# EAGLE schematic CD (EAGLE 7.2.0)

## Sheet 1 of 2
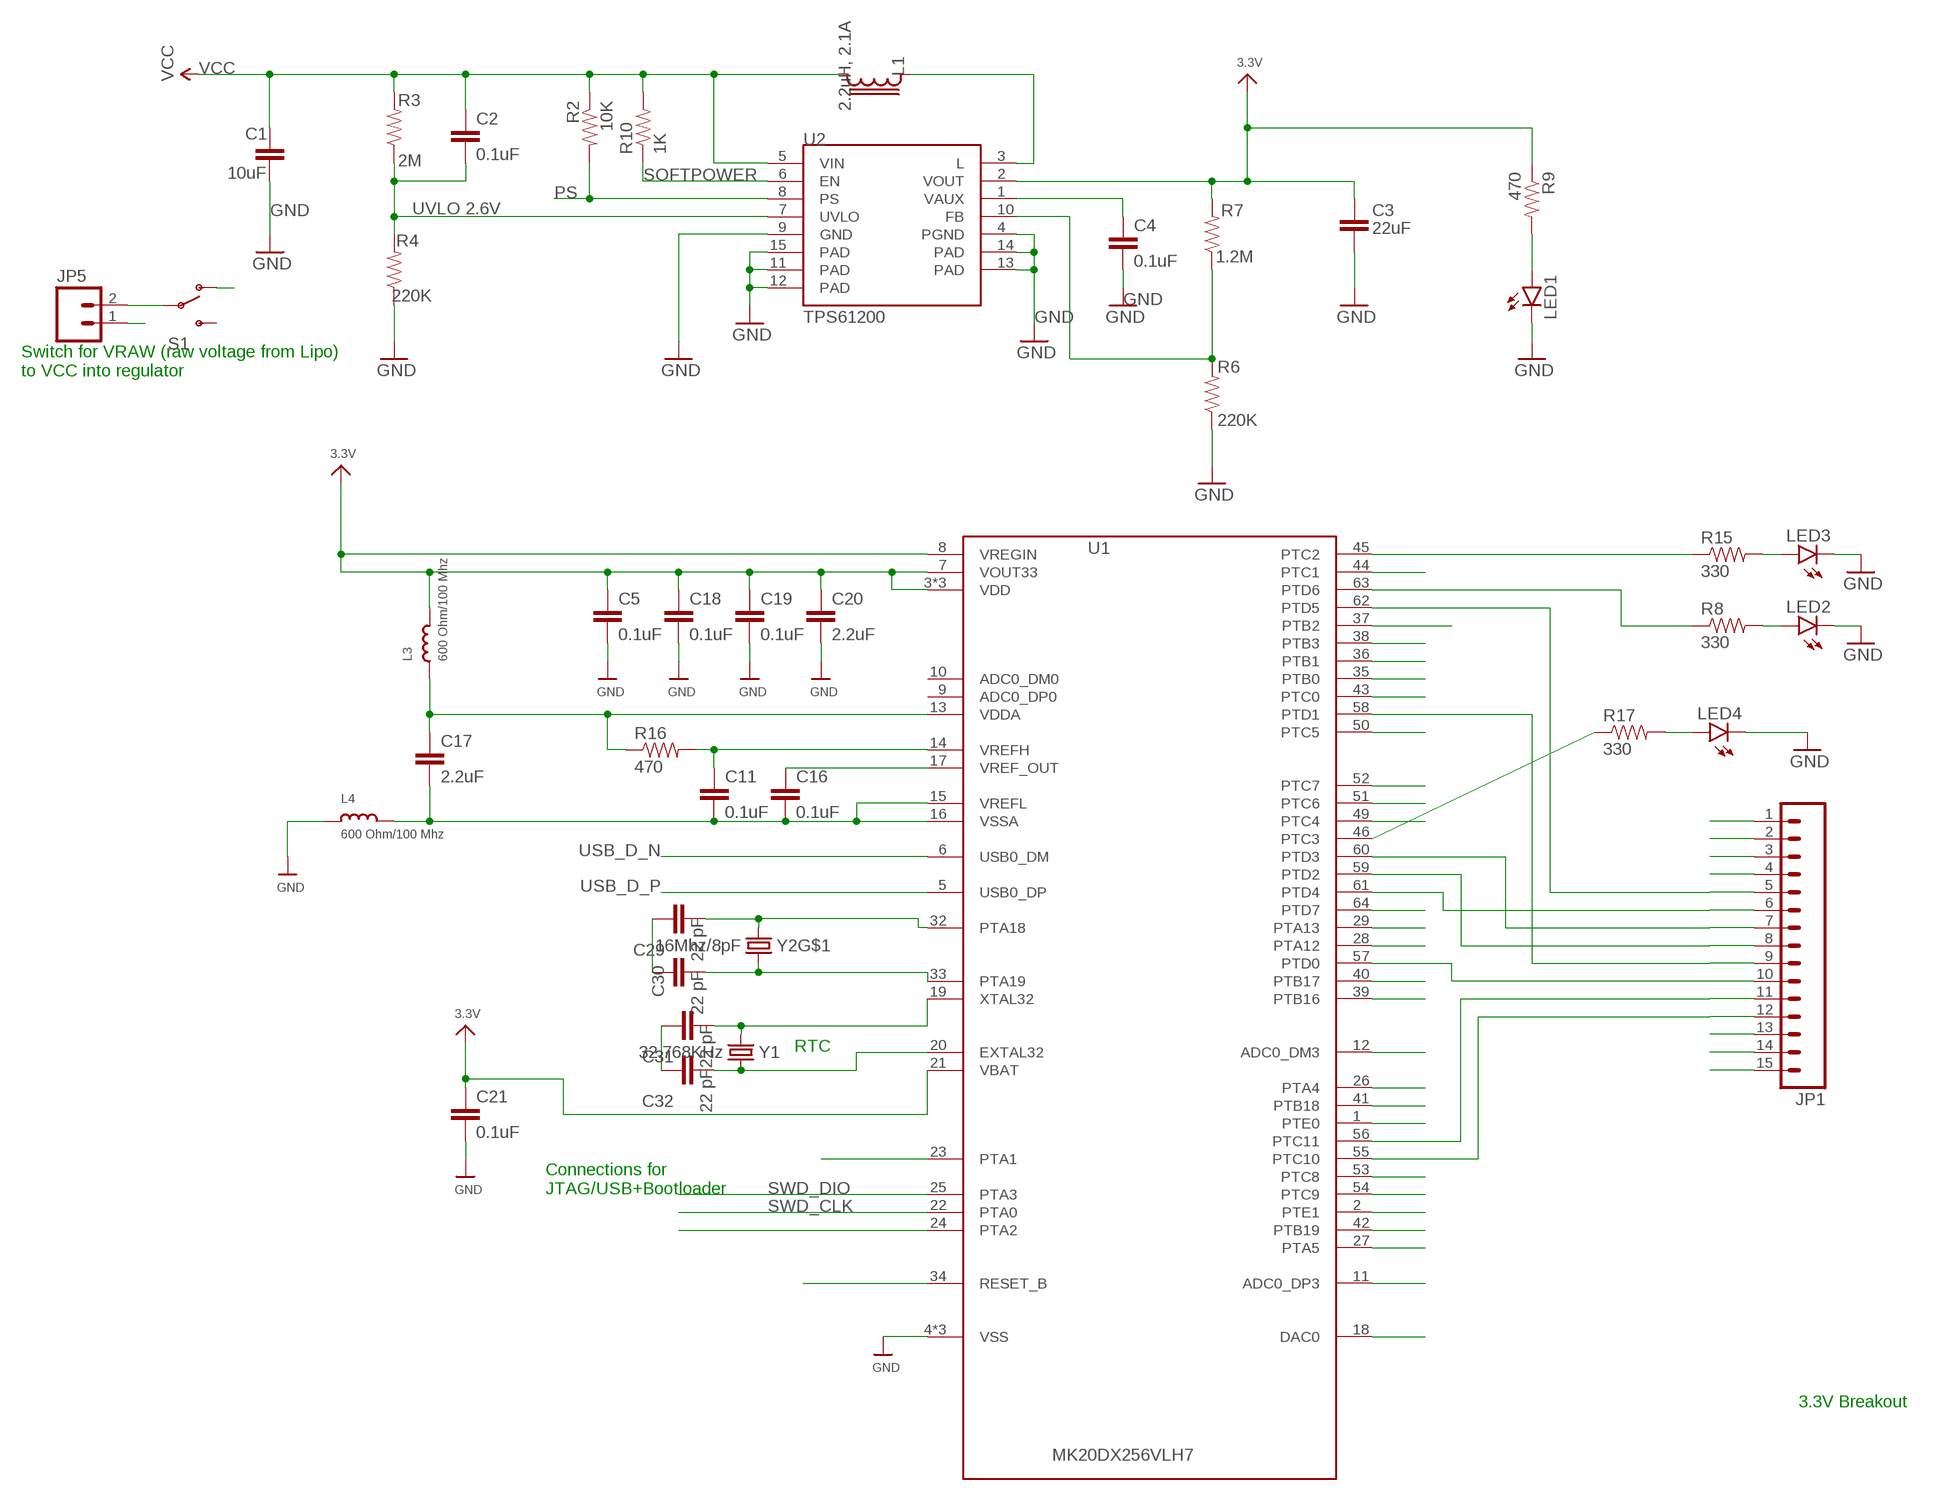
[diagram p0: schematic, sheet 1]

### Parts
C1  10uF  CAPACITOR-10UF  [0603-CAP]
C2  0.1uF  CAPACITOR-0.1UF  [0603-CAP]
C3  22uF  CAPACITOR-22UF  [0603-CAP]
C4  0.1uF  CAPACITOR-0.1UF  [0603-CAP]
C5  0.1uF  CAPACITOR-0.1UF  [0603-CAP]
C11  0.1uF  CAPACITOR-0.1UF  [0603-CAP]
C16  0.1uF  CAPACITOR-0.1UF  [0603-CAP]
C17  2.2uF  CAPACITOR-2.2UF  [0603-CAP]
C18  0.1uF  CAPACITOR-0.1UF  [0603-CAP]
C19  0.1uF  CAPACITOR-0.1UF  [0603-CAP]
C20  2.2uF  CAPACITOR-2.2UF  [0603-CAP]
C21  0.1uF  CAPACITOR-0.1UF  [0603-CAP]
C29  22 pF  CAPACITOR-10UF  [0603-CAP]
C30  22 pF  CAPACITOR-10UF  [0603-CAP]
C31  22 pF  CAPACITOR-10UF  [0603-CAP]
C32  22 pF  CAPACITOR-10UF  [0603-CAP]
JP1  M15  [1X15]
JP5  M02PTH  [1X02]
L1  2.2uH, 2.1A  LPS30152.2UH  [LPS3015]
L3  600 Ohm/100 Mhz  INDUCTOR-BK2125HM601-T  [0805]
L4  600 Ohm/100 Mhz  INDUCTOR-BK2125HM601-T  [0805]
LED1  LED-GREEN  [LED-0603]
LED2  LED-GREEN  [LED-0603]
LED3  LED-GREEN  [LED-0603]
LED4  LED-GREEN  [LED-0603]
R2  10K  RESISTOR-10K  [0603-RES]
R3  2M  RESISTOR-2M  [0603-RES]
R4  220K  RESISTOR-220K  [0603-RES]
R6  220K  RESISTOR-220K  [0603-RES]
R7  1.2M  RESISTOR-1.2M  [0603-RES]
R8  330  RESISTOR-470  [0603-RES]
R9  470  RESISTOR-470  [0603-RES]
R10  1K  RESISTOR-1K  [0603-RES]
R15  330  RESISTOR-470  [0603-RES]
R16  470  RESISTOR-470  [0603-RES]
R17  330  RESISTOR-470  [0603-RES]
S1  SWITCH-SPDT-SMD-A  [SWITCH-SPST-SMD-A]
U1  MK20DX256VLH7  [MK20DX256VLH7]
U2  TPS61200  [QFN-10_PAD]
Y1  32.768KHz  CRYSTAL/32.768KHZ/SMD-TXC_7A  [CRYSTAL-TXC-7A]
Y2  16Mhz/8pF  CRYSTAL/SMD-5X3-GND16MHZ/8PF  [CRYSTAL-SMD-5X3]

### Nets
3.3V: C3.1 C5.1 C18.1 C19.1 C20.1 C21.1 JP1.13 JP1.14 JP1.15 L3.2 R7.2 R9.1 U1.3(VDD) U1.7(VOUT33) U1.8(VREGIN) U1.21(VBAT) U1.30(VDD) U1.48(VDD) U2.2(VOUT) ; also sheet 2
A12: U1.11(ADC0_DP3)
A13: U1.12(ADC0_DM3)
AD0: U1.39(PTB16) ; also sheet 2
DAC/A14: U1.18(DAC0)
FB: R6.2 R7.1 U2.10(FB)
GND [Top GND Pour]: C1.2 C3.2 C4.2 C5.2 C18.2 C19.2 C20.2 C21.2 C29.1 C30.1 C31.1 C32.1 JP1.1 JP1.2 JP1.3 JP1.4 JP5.1 L4.1 LED1.C LED2.C LED3.C LED4.C R4.1 R6.1 U1.4(VSS) U1.31(VSS) U1.47(VSS) U2.4(PGND) U2.9(GND) U2.11(PAD) U2.12(PAD) U2.13(PAD) U2.14(PAD) U2.15(PAD) ; also sheet 2
ID: U1.23(PTA1)
N$1: LED1.A R9.2
N$2: L1.1 U2.3(L)
N$7: LED2.A R8.2
N$8: LED3.A R15.2
N$9: R17.1 U1.46(PTC3)
N$10: C31.2 U1.19(XTAL32) Y1.P$2
N$11: C32.2 U1.20(EXTAL32) Y1.P$1
N$27: C29.2 U1.32(PTA18) Y2.3
N$28: C30.2 U1.33(PTA19) Y2.1
N$29: LED4.A R17.2
PS: R2.2 U2.8(PS)
PTA2: U1.24(PTA2)
PTA4: U1.26(PTA4)
PTA5: U1.27(PTA5)
PTA12: U1.28(PTA12)
PTA13: U1.29(PTA13)
PTB0: U1.35(PTB0) ; also sheet 2
PTB1: U1.36(PTB1) ; also sheet 2
PTB17: U1.40(PTB17) ; also sheet 2
PTB18: U1.41(PTB18) ; also sheet 2
PTB19: U1.42(PTB19) ; also sheet 2
PTC0: U1.43(PTC0) ; also sheet 2
PTC1: U1.44(PTC1) ; also sheet 2
PTC2: R15.1 U1.45(PTC2)
PTC4: U1.49(PTC4) ; also sheet 2
PTC5: U1.50(PTC5) ; also sheet 2
PTC6: U1.51(PTC6) ; also sheet 2
PTC7: U1.52(PTC7) ; also sheet 2
PTC8: U1.53(PTC8) ; also sheet 2
PTC9: U1.54(PTC9) ; also sheet 2
PTC10: JP1.12 U1.55(PTC10)
PTC11: JP1.11 U1.56(PTC11)
PTD0: JP1.10 U1.57(PTD0)
PTD1: JP1.9 U1.58(PTD1)
PTD2: JP1.8 U1.59(PTD2)
PTD3: JP1.7 U1.60(PTD3)
PTD4: JP1.6 U1.61(PTD4)
PTD5: JP1.5 U1.62(PTD5)
PTD6: R8.1 U1.63(PTD6)
PTD7: U1.64(PTD7)
PTE0: U1.1(PTE0)
PTE1: U1.2(PTE1)
RESET_B: U1.34(RESET_B)
SCL: U1.37(PTB2) ; also sheet 2
SDA: U1.38(PTB3) ; also sheet 2
SOFTPOWER: R10.1 U2.6(EN)
SWD_CLK: U1.22(PTA0)
SWD_DIO: U1.25(PTA3)
USB_D_N [USB]: U1.6(USB0_DM)
USB_D_P [USB]: U1.5(USB0_DP)
UVLO: C2.2 R3.1 R4.2 U2.7(UVLO)
VAUX: C4.1 U2.1(VAUX)
VCC: C1.1 C2.1 L1.2 R2.1 R3.2 R10.2 S1.1(O) U2.5(VIN)
VDDA: C17.1 L3.1 R16.1 U1.13(VDDA)
VRAW [Top GND Pour]: JP5.2 S1.2(P)
VREF_OUT: C16.1 U1.17(VREF_OUT)
VREFH: C11.1 R16.2 U1.14(VREFH)
VREFL: C11.2 C16.2 C17.2 L4.2 U1.15(VREFL) U1.16(VSSA)
Unconnected: S1.3(S) U1.9(ADC0_DP0) U1.10(ADC0_DM0) Y2.2(GND:GND) Y2.4(GND:GND)

### Notes on the sheet
- UVLO 2.6V
- Switch for VRAW (raw voltage from Lipo) 
  to VCC into regulator
- RTC
- Connections for 
  JTAG/USB+Bootloader
- 3.3V Breakout

## Sheet 2 of 2
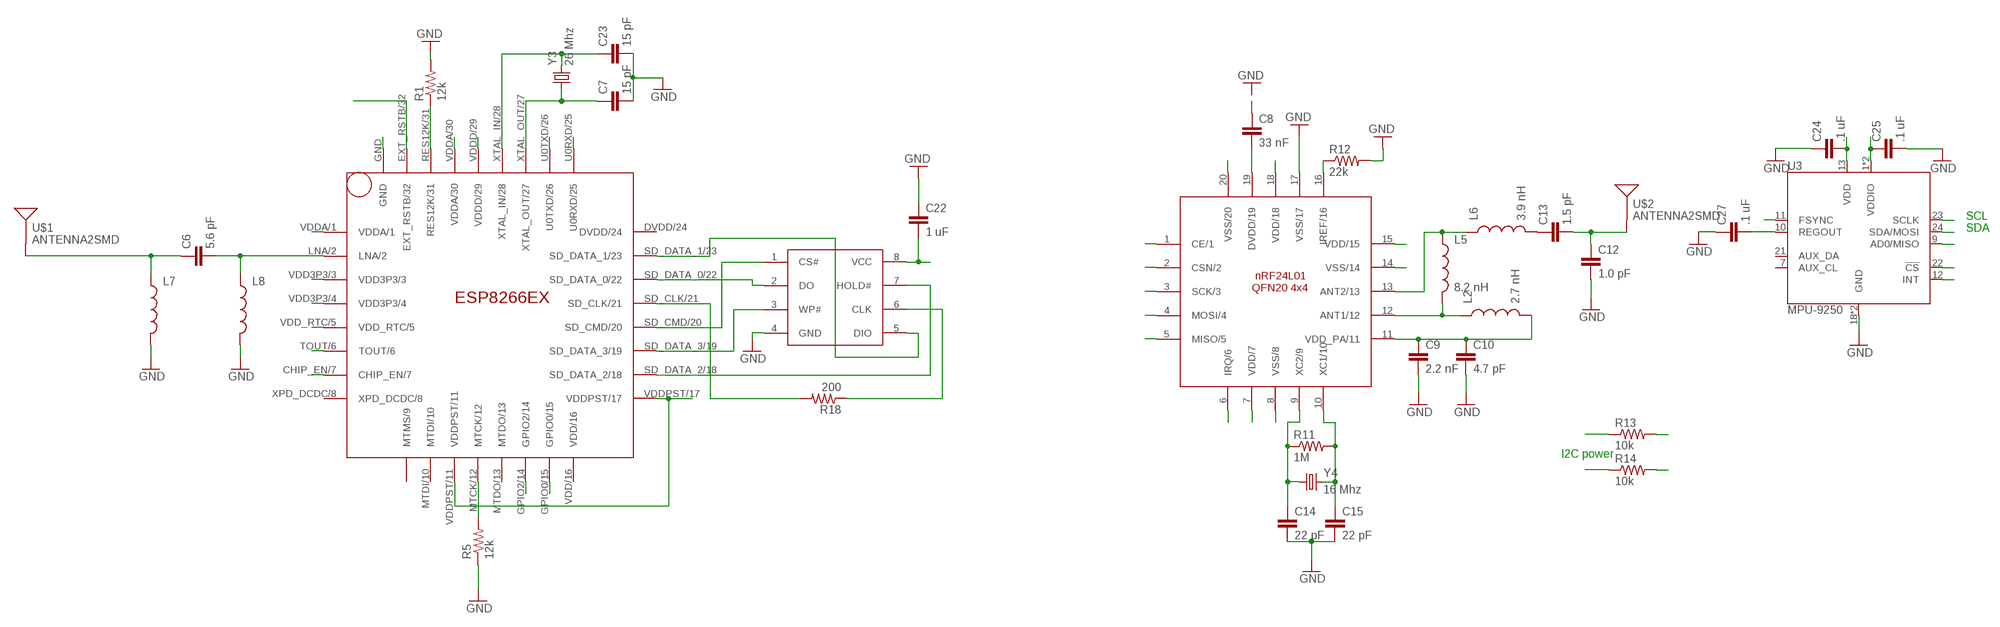
[diagram p1: schematic, sheet 2]

### Parts
C6  5.6 pF  CAP0603-CAP  [0603-CAP]
C7  15 pF  CAP0603-CAP  [0603-CAP]
C8  33 nF  CAP0603-CAP  [0603-CAP]
C9  2.2 nF  CAP0603-CAP  [0603-CAP]
C10  4.7 pF  CAP0603-CAP  [0603-CAP]
C12  1.0 pF  CAP0603-CAP  [0603-CAP]
C13  1.5 pF  CAP0603-CAP  [0603-CAP]
C14  22 pF  CAP0603-CAP  [0603-CAP]
C15  22 pF  CAP0603-CAP  [0603-CAP]
C22  1 uF  CAP0603-CAP  [0603-CAP]
C23  15 pF  CAP0603-CAP  [0603-CAP]
C24  .1 uF  CAP0603-CAP  [0603-CAP]
C25  .1 uF  CAP0603-CAP  [0603-CAP]
C27  .1 uF  CAP0603-CAP  [0603-CAP]
L2  2.7 nH  INDUCTOR0402  [C0402]
L5  8.2 nH  INDUCTOR0402  [C0402]
L6  3.9 nH  INDUCTOR0402  [C0402]
L7  INDUCTOR30OHM,1.8A  [0603]
L8  INDUCTOR30OHM,1.8A  [0603]
R1  12k  RESISTOR0603-RES  [0603-RES]
R5  12k  RESISTOR0603-RES  [0603-RES]
R11  1M  RESISTOR0603-RES  [0603-RES]
R12  22k  RESISTOR0603-RES  [0603-RES]
R13  10k  RESISTOR0603-RES  [0603-RES]
R14  10k  RESISTOR0603-RES  [0603-RES]
R18  200  RESISTOR0603-RES  [0603-RES]
U3  MPU-9250  [QFN-24/3MM]
U$1  ANTENNA2SMD  [ANTENNA-CHIP2]
U$2  ANTENNA2SMD  [ANTENNA-CHIP2]
U$3  25Q40  [SOP8]
U$4  NRF24L01  [QFN20(4X4)]
U$6  ESP8266EX  [QFN32]
Y3  26 Mhz  CRYSTAL5X3  [CRYSTAL-SMD-5X3]
Y4  16 Mhz  CRYSTAL5X3  [CRYSTAL-SMD-5X3]

### Nets
3.3V: C22.2 C24.2 C25.1 R13.1 R14.1 U3.1(VDDIO) U3.8(VDDIO) U3.13(VDD) U3.22(!CS) U$3.8(VCC) U$4.7(VDD/7) U$4.15(VDD/15) U$4.18(VDD/18) U$6.VDD3P3/3 U$6.VDD3P3/4 U$6.VDDA/1 U$6.VDDD/29 U$6.VDDPST/11 U$6.VDDPST/17 ; also sheet 1
AD0: U3.9(AD0/MISO) ; also sheet 1
GND [Top GND Pour]: C7.2 C8.1 C9.2 C10.2 C12.2 C14.2 C15.2 C22.1 C23.2 C24.1 C25.2 C27.1 L7.2 L8.2 R1.2 R5.1 R12.2 U3.18(GND) U3.20(GND) U$3.4(GND) U$4.8(VSS/8) U$4.14(VSS/14) U$4.17(VSS/17) U$4.20(VSS/20) U$6.GND ; also sheet 1
N$13: C6.2 L8.1 U$6.LNA/2
N$16: C6.1 L7.1 U$1.FEED(SIGNAL)
N$17: C14.1 R11.1 U$4.9(XC2/9) Y4.1
N$18: C15.1 R11.2 U$4.10(XC1/10) Y4.3
N$19: C9.1 C10.1 L2.2 U$4.11(VDD_PA/11)
N$20: L5.1 L6.1 U$4.13(ANT2/13)
N$21: C8.2 U$4.19(DVDD/19)
N$23: L2.1 L5.2 U$4.12(ANT1/12)
N$24: R12.1 U$4.16(IREF/16)
N$25: C13.1 L6.2
N$26: C12.1 C13.2 U$2.FEED(SIGNAL)
N$32: R5.2 U$6.MTCK/12
N$34: C27.2 U3.10(REGOUT)
N$35: R18.1 U$3.6(CLK)
N$38: R1.1 U$6.RES12K/31
PTB0: U3.12(INT) ; also sheet 1
PTB1: U3.11(FSYNC) ; also sheet 1
PTB16: U$6.U0RXD/25
PTB17: U$6.U0TXD/26 ; also sheet 1
PTB18: U$6.GPIO0/15 ; also sheet 1
PTB19: U$6.GPIO2/14 ; also sheet 1
PTC0: U$6.EXT_RSTB/32 ; also sheet 1
PTC1: U$6.CHIP_EN/7 ; also sheet 1
PTC4: U$4.2(CSN/2) ; also sheet 1
PTC5: U$4.3(SCK/3) ; also sheet 1
PTC6: U$4.4(MOSI/4) ; also sheet 1
PTC7: U$4.5(MISO/5) ; also sheet 1
PTC8: U$4.6(IRQ/6) ; also sheet 1
PTC9: U$4.1(CE/1) ; also sheet 1
RTC: U$6.VDD_RTC/5
SCL: R14.2 U3.23(SCLK) ; also sheet 1
SD-CLK: R18.2 U$6.SD_CLK/21
SD-CMD: U$3.1(CS#) U$6.SD_CMD/20
SD-D0: U$3.2(DO) U$6.SD_DATA_0/22
SD-D1: U$3.5(DIO) U$6.SD_DATA_1/23
SD-D2: U$3.7(HOLD#) U$6.SD_DATA_2/18
SD-D3: U$3.3(WP#) U$6.SD_DATA_3/19
SDA: R13.2 U3.24(SDA/MOSI) ; also sheet 1
TOUT: U$6.TOUT/6
VDD: U$6.VDDA/30
XTAL_IN: C23.1 U$6.XTAL_IN/28 Y3.3
XTAL_OUT: C7.1 U$6.XTAL_OUT/27 Y3.1
Unconnected: U3.7(AUX_CL) U3.21(AUX_DA) U$6.DVDD/24 U$6.MTDI/10 U$6.MTDO/13 U$6.MTMS/9 U$6.VDD/16 U$6.XPD_DCDC/8

### Notes on the sheet
- SCL
- SDA
- I2C power

## Library data of the parts
C1 = appfruits:CAPACITOR; MF: Murata; MPN: GRM188R60J106ME47D
C2 C4 C5 C11 C16 C18 C19 C21 = appfruits:CAPACITOR; MF: Kemet; MPN: C0603C104J3RACTU
C3 = appfruits:CAPACITOR; MF: Murata; MPN: GRM188R60J226MEA0D
C6-C10 C12-C15 C22-C25 C27 = SparkFun-Capacitors:CAP: Capacitor Standard 0603 ceramic capacitor, and 0.1" leaded capacitor.
C17 C20 = appfruits:CAPACITOR; MF: Kemet; MPN: C0603C225K4PACTU
C29-C32 = appfruits:CAPACITOR; MF: Murata; MPN: GRM188R60J106ME47D; VALUE: 10uF
JP1 = SparkFun-Connectors:M15: Header 15 Standard 15-pin 0.1" header. Use with straight break away headers (SKU : PRT-00116), right angle break away headers (PRT-00553), swiss pins (PRT-00743), machine pins (PRT-00117), and female headers (PRT-00115).
JP5 = SparkFun-Connectors:M02: Standard 2-pin 0.1" header. Use with - straight break away headers ( PRT-00116) - right angle break away headers (PRT-00553) - swiss pins (PRT-00743) - machine pins (PRT-00117) - female headers (PRT-00115) Molex polarized connector foot print use with: PRT-08233 with associated crimp pins and housings. 2.54_SCREWTERM for use with PRT-10571. 3.5mm Screw Terminal footprints for PRT-08084 5mm Screw Terminal footprints for use with PRT-08432
L1 = appfruits:LPS3015: Shielded Power Inductor; MF: Coilcraft; MPN: LPS3015-222MRB
L2 L5 L6 = SparkFun-Passives:INDUCTOR: Inductors
L3 L4 = appfruits:INDUCTOR: Inductors; MF: Taiyo Yuden; MPN: BK2125HM601-T
L7 L8 = SparkFun-Passives:INDUCTOR: Inductors; PROD_ID: RES-07859
LED1-LED4 = appfruits:LED: LEDs Standard schematic elements and footprints for 5mm, 3mm, 1206, and 0603 sized LEDs. 5mm - Spark Fun Electronics SKU : COM-00529 (and others); MF: Avago; MPN: HSMG-C190
R1 R5 R11-R14 R18 = SparkFun-Resistors:RESISTOR: Resistor Basic schematic elements and footprints for 0603, 1206, and PTH resistors.
R2 = appfruits:RESISTOR: Resistor Basic schematic elements and footprints for 0603, 1206, and PTH resistors.; MF: Panasonic; MPN: ERJ-3GEYJ103V
R3 = appfruits:RESISTOR: Resistor Basic schematic elements and footprints for 0603, 1206, and PTH resistors.; MF: Panasonic; MPN: ERJ-3GEYJ205V
R4 R6 = appfruits:RESISTOR: Resistor Basic schematic elements and footprints for 0603, 1206, and PTH resistors.; MF: Panasonic; MPN: ERJ-3GEYJ224V
R7 = appfruits:RESISTOR: Resistor Basic schematic elements and footprints for 0603, 1206, and PTH resistors.; MF: Panasonic; MPN: ERJ-3GEYJ125V
R8 R15 R17 = appfruits:RESISTOR: Resistor Basic schematic elements and footprints for 0603, 1206, and PTH resistors.; MF: Panasonic; MPN: ERJ-3GEYJ471V; VALUE: 470
R9 R16 = appfruits:RESISTOR: Resistor Basic schematic elements and footprints for 0603, 1206, and PTH resistors.; MF: Panasonic; MPN: ERJ-3GEYJ471V
R10 = appfruits:RESISTOR: Resistor Basic schematic elements and footprints for 0603, 1206, and PTH resistors.; MF: Panasonic; MPN: ERJ-3GEYJ102V
S1 = SparkFun-Electromechanical:SWITCH-SPDT: SPDT Switch Simple slide switch, Spark Fun Electronics SKU : COM-00102 DPDT SMT slide switch, AYZ0202, SWCH-08179
U1 = appfruits:MK20DX256VLH7; MF: Freescale; MPN: MK20DX256VLH7
U2 = appfruits:TPS61200: DC to DC Booster IC-10035; MF: Texas Instruments; MPN: TPS61200DRCR; PROD_ID: IC-10035
U3 = chips:MPU-9250: GYRO/ACCEL/COMPASS/9-AXIS; DIGIKEY: 1428-1019-1-ND
U$1 U$2 = SparkFun-RF:ANTENNA2: Chip antenna Single endded antenna. Common with smaller chip antennas. CHIP4 package is the GPS Chip Antenna SKU: GPS-08418. CHIP5 package is 2.4GHz chip antenna SKU: WRL-00144.
U$3 = wifi:25Q40
U$4 = RF:NRF24L01
U$6 = wifi:ESP8266EX
Y1 = appfruits:CRYSTAL/32.768KHZ/SMD-TXC_7A; MF: Epson Timing; MPN: FC-255 32.7680K-A3
Y2 = appfruits:CRYSTAL/SMD-5X3-GND; MF: ECS; MPN: ECS-160-8-30B-CKM
Y3 Y4 = SparkFun-FreqCtrl:CRYSTAL: Various standard crystals. Proven footprints.; PROD_ID: XTAL-08218

## Net classes
1 USB: width 0.254 mm, drill 0.33 mm, clearance 0.159 mm